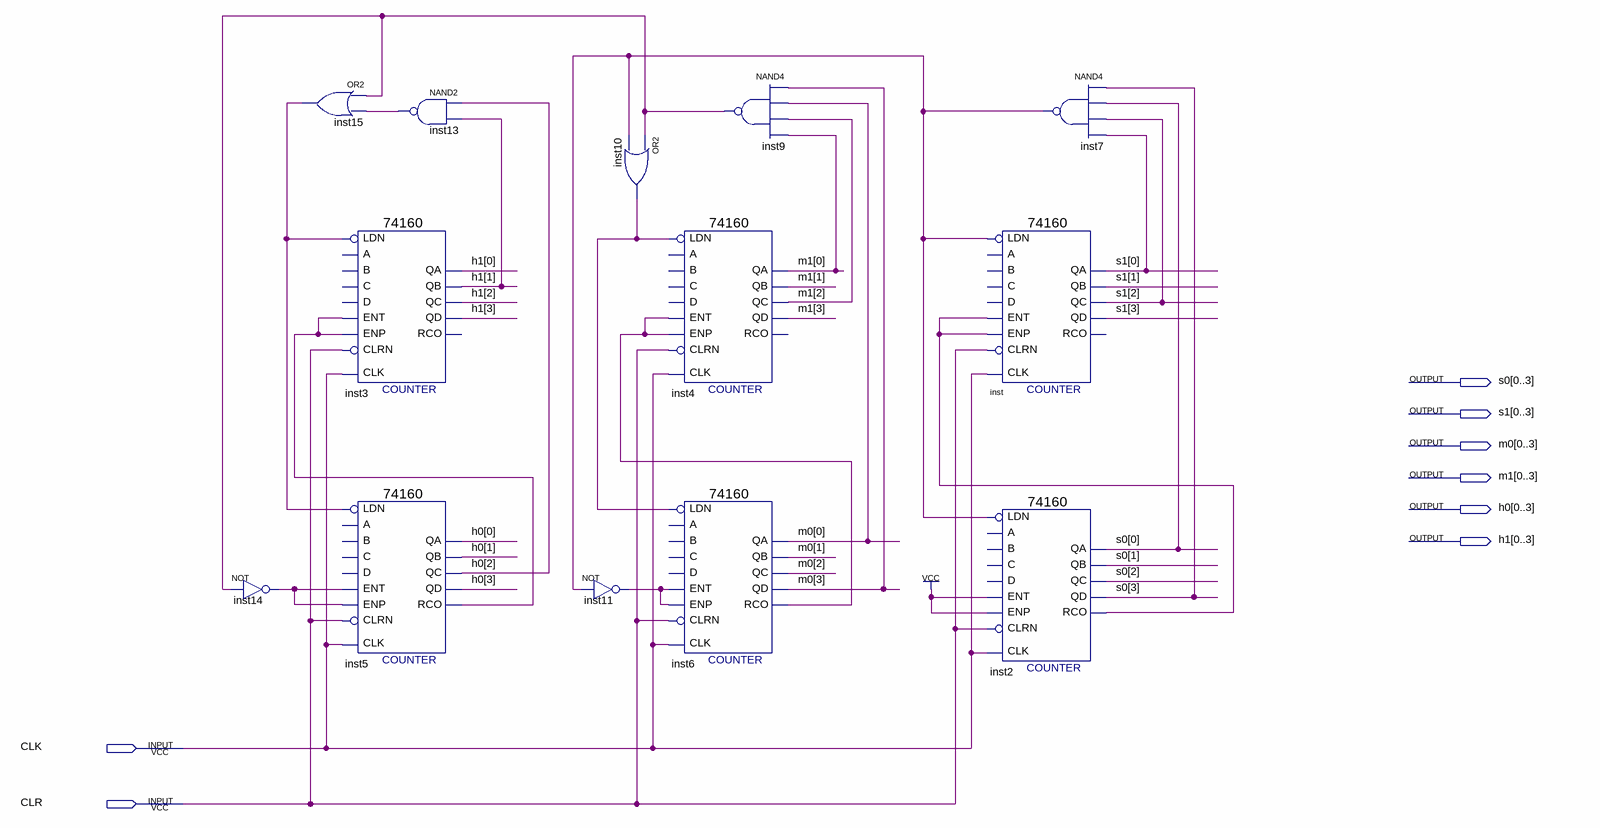
[diagram p0: schematic sheet]
// Quartus schematic HMS_Counter.bdf as structural Verilog: 13 symbols, 8 pins
module HMS_Counter (
  input  CLK,
  input  CLR,
  output [0:3] s0,
  output [0:3] s1,
  output [0:3] m0,
  output [0:3] m1,
  output [0:3] h0,
  output [0:3] h1
);

  wire inst2_rco, inst5_rco, inst6_rco, inst7_out, inst9_out, inst10_out, inst11_out, inst13_out, inst14_out,
       inst15_out;

  not inst14 (inst14_out, inst9_out);
  or inst15 (inst15_out, inst9_out, inst13_out);
  nand inst13 (inst13_out, h0[2], h1[1]);
  \74160  inst3 (
    .CLK(CLK), .ENT(inst5_rco), .LDN(inst15_out), .ENP(inst5_rco), .CLRN(CLR), .QD(h1[3]), .QA(h1[0]),
    .QB(h1[1]), .QC(h1[2]));  // open: A, B, C, D, RCO
  \74160  inst5 (
    .CLK(CLK), .ENT(inst14_out), .LDN(inst15_out), .ENP(inst14_out), .CLRN(CLR), .QD(h0[3]), .QA(h0[0]),
    .QB(h0[1]), .QC(h0[2]), .RCO(inst5_rco));  // open: A, B, C, D
  not inst11 (inst11_out, inst7_out);
  or inst10 (inst10_out, inst9_out, inst7_out);
  \74160  inst4 (
    .CLK(CLK), .ENT(inst6_rco), .LDN(inst10_out), .ENP(inst6_rco), .CLRN(CLR), .QD(m1[3]), .QA(m1[0]),
    .QB(m1[1]), .QC(m1[2]));  // open: A, B, C, D, RCO
  \74160  inst6 (
    .CLK(CLK), .ENT(inst11_out), .LDN(inst10_out), .ENP(inst11_out), .CLRN(CLR), .QD(m0[3]), .QA(m0[0]),
    .QB(m0[1]), .QC(m0[2]), .RCO(inst6_rco));  // open: A, B, C, D
  nand inst9 (inst9_out, m0[3], m0[0], m1[2], m1[0]);
  \74160  inst (
    .CLK(CLK), .ENT(inst2_rco), .LDN(inst7_out), .ENP(inst2_rco), .CLRN(CLR), .QD(s1[3]), .QA(s1[0]),
    .QB(s1[1]), .QC(s1[2]));  // open: A, B, C, D, RCO
  \74160  inst2 (
    .CLK(CLK), .ENT(1'b1), .LDN(inst7_out), .ENP(1'b1), .CLRN(CLR), .QD(s0[3]), .QA(s0[0]), .QB(s0[1]),
    .QC(s0[2]), .RCO(inst2_rco));  // open: A, B, C, D
  nand inst7 (inst7_out, s0[3], s0[0], s1[2], s1[0]);
endmodule
